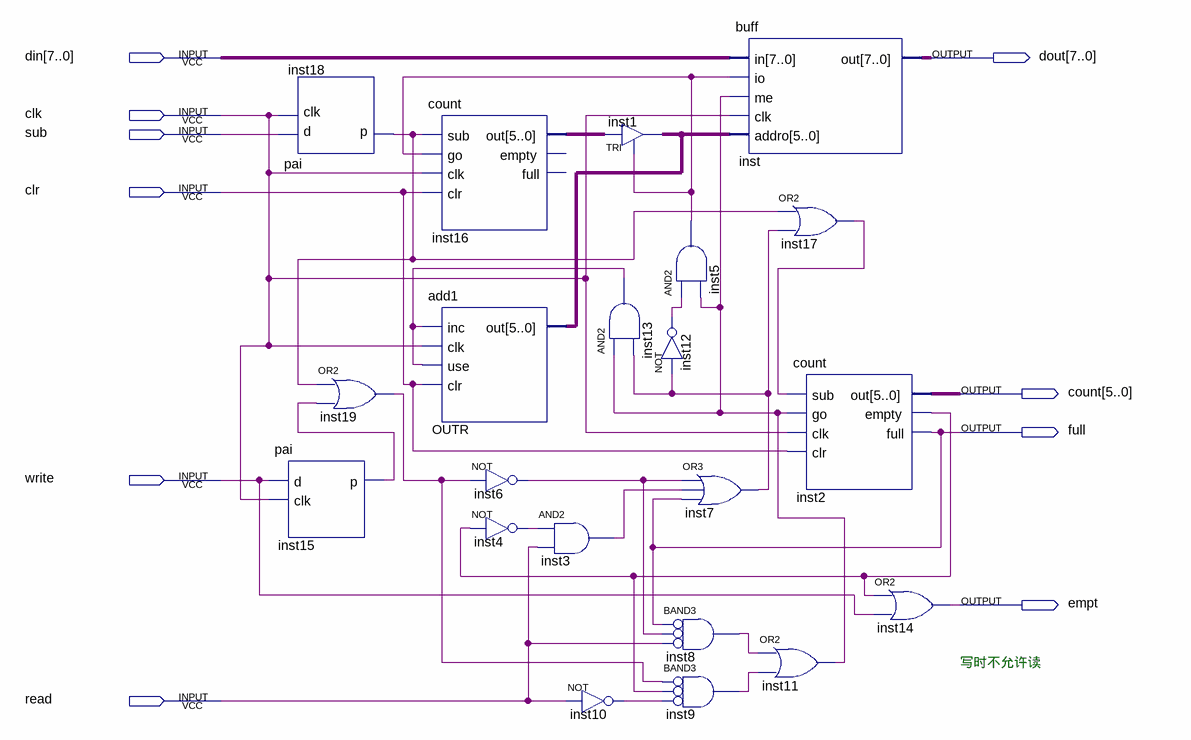
[diagram p0: schematic sheet]
// Quartus schematic inputa1.bdf as structural Verilog: 21 symbols, 10 pins
module inputa1 (
  input  [7:0] din,
  input  clk,
  input  sub,
  input  clr,
  input  write,
  input  read,
  output [7:0] dout,
  output [5:0] count,
  output full,
  output empt
);

  wire inst2_empty, inst3_out, inst4_out, inst5_out, inst6_out, inst7_out, inst8_out, inst9_out, inst10_out,
       inst11_out, inst12_out, inst13_out, inst15_p, inst17_out, inst18_p, inst19_out;
  wire [5:0] inst16_out, OUTR_out;

  pai inst15 (.d(write), .clk(clk), .p(inst15_p));
  pai inst18 (.d(sub), .clk(clk), .p(inst18_p));
  or inst19 (inst19_out, inst18_p, inst15_p);
  count inst16 (.sub(inst18_p), .go(inst5_out), .clk(clk), .clr(clr), .out(inst16_out));  // open: empty, full
  add1 OUTR (.inc(inst13_out), .clk(clk), .\use (inst13_out), .clr(clr), .out(OUTR_out));
  not inst6 (inst6_out, inst19_out);
  not inst4 (inst4_out, inst2_empty);
  and inst3 (inst3_out, inst4_out, read);
  not inst10 (inst10_out, read);
  TRI inst1[5:0] (.IN(inst16_out), .OE(inst5_out), .OUT(OUTR_out));
  and inst13 (inst13_out, inst11_out, inst7_out);
  not inst12 (inst12_out, inst7_out);
  buff inst (.in(din), .io(inst5_out), .me(inst11_out), .clk(clk), .addro(OUTR_out), .out(dout));
  and inst5 (inst5_out, inst12_out, inst11_out);
  or inst7 (inst7_out, inst6_out, inst3_out, full);
  and inst8 (inst8_out, ~full, ~inst6_out, ~read);  // BAND3
  and inst9 (inst9_out, ~inst19_out, ~inst2_empty, ~inst10_out);  // BAND3
  or inst17 (inst17_out, inst18_p, inst7_out);
  count inst2 (.sub(inst17_out), .go(inst11_out), .clk(clk), .clr(clr), .out(count), .empty(inst2_empty), .full(full));
  or inst11 (inst11_out, inst8_out, inst9_out);
  or inst14 (empt, inst2_empty, write);

  // Notes on the sheet:
  //   写时不允许读
endmodule
